# EAGLE schematic auxboard-schematics (EAGLE 7.6.0)
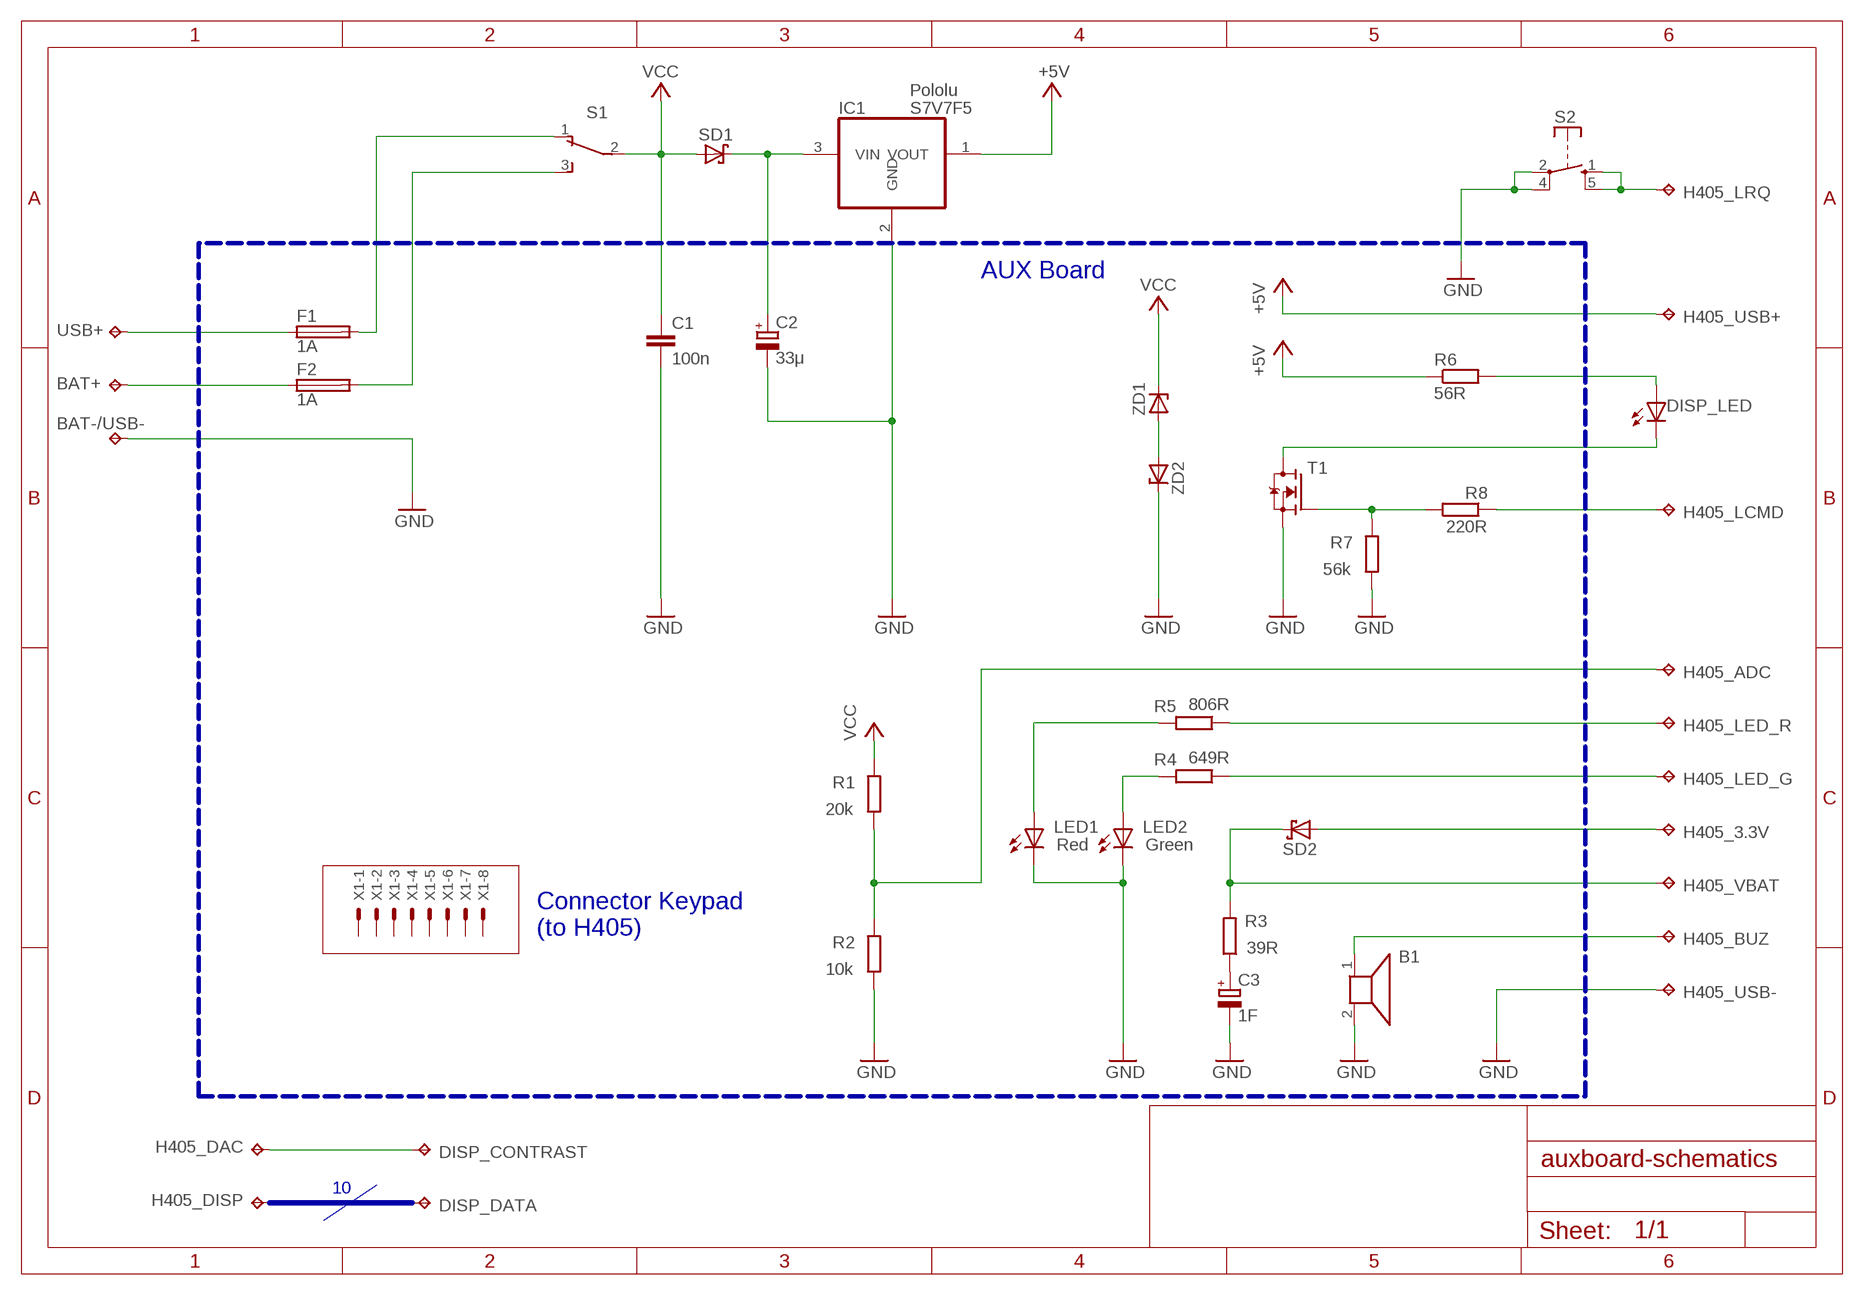
[diagram p0: schematic, sheet 1]

## Parts
B1  F/SMX  [F/SMX]
BAT+  TPPAD1-17  [P1-17]
BAT-/USB-  TPPAD1-17  [P1-17]
C1  100n  C-EU050-035X075  [C050-035X075]
C2  33μ  CPOL-EUUD-5X5,8  [UD-5X5,8_NICHICON]
C3  1F  CPOL-EUUD-5X5,8  [UD-5X5,8_NICHICON]
DISP_CONTRAST  TPPAD1-17  [P1-17]
DISP_DATA  TPPAD1-17  [P1-17]
DISP_LED  LAP4-BOTTOM  [P47F-BOTTOM]
F1  1A  FUSESH22,5A  [SH22,5A]
F2  1A  FUSESH22,5A  [SH22,5A]
H405_3.3V  TPPAD1-17  [P1-17]
H405_ADC  TPPAD1-17  [P1-17]
H405_BUZ  TPPAD1-17  [P1-17]
H405_DAC  TPPAD1-17  [P1-17]
H405_DISP  TPPAD1-17  [P1-17]
H405_LCMD  TPPAD1-17  [P1-17]
H405_LED_G  TPPAD1-17  [P1-17]
H405_LED_R  TPPAD1-17  [P1-17]
H405_LRQ  TPPAD1-17  [P1-17]
H405_USB+  TPPAD1-17  [P1-17]
H405_USB-  TPPAD1-17  [P1-17]
H405_VBAT  TPPAD1-17  [P1-17]
IC1  S7V7F5  REG1118  [SOT223]
LED1  Red  LAP4-BOTTOM  [P47F-BOTTOM]
LED2  Green  LAP4-BOTTOM  [P47F-BOTTOM]
R1  20k  R-EU_0207/2V  [0207/2V]
R2  10k  R-EU_0207/2V  [0207/2V]
R3  39R  R-EU_0207/2V  [0207/2V]
R4  649R  R-EU_0207/2V  [0207/2V]
R5  806R  R-EU_0207/2V  [0207/2V]
R6  56R  R-EU_0207/2V  [0207/2V]
R7  56k  R-EU_0207/2V  [0207/2V]
R8  220R  R-EU_0207/2V  [0207/2V]
S1  TL36YO  [TL3XYO]
S2  TME1  [TME1]
SD1  SCHOTTKY-DIODECB417-15  [CB417-15]
SD2  SCHOTTKY-DIODECB417-15  [CB417-15]
T1  SPW47N60S5  [P-TO247]
USB+  TPPAD1-17  [P1-17]
X1  22-23-2081  [22-23-2081]
ZD1  1N5333  [C1702-15]
ZD2  1N5333  [C1702-15]

## Nets
+5V: H405_USB+.TP IC1.1(VOUT) R6.1
GND: B1.2 BAT-/USB-.TP C1.2 C2.- C3.- H405_USB-.TP IC1.2(GND) LED1.C LED2.C R2.1 R7.1 S2.2(P) S2.4(P) T1.3(S) ZD2.C
N$1: F1.1 USB+.TP
N$2: BAT+.TP F2.1
N$3: R7.2 R8.2 T1.1(G)
N$4: F2.2 S1.3(S)
N$5: H405_LRQ.TP S2.1(S) S2.5(S)
N$6: DISP_LED.A R6.2
N$7: F1.2 S1.1(O)
N$8: DISP_LED.C T1.2(D)
N$9: H405_LCMD.TP R8.1
N$10: B1.1 H405_BUZ.TP
N$11: H405_ADC.TP R1.1 R2.2
N$12: H405_3.3V.TP SD2.A
N$13: H405_VBAT.TP R3.2 SD2.C
N$14: C3.+ R3.1
N$15: LED2.A R4.2
N$16: LED1.A R5.2
N$17: H405_LED_R.TP R5.1
N$18: H405_LED_G.TP R4.1
N$20: ZD1.A ZD2.A
N$21: C2.+ IC1.3(VIN) SD1.C
N$22: DISP_CONTRAST.TP H405_DAC.TP
VCC: C1.1 R1.2 S1.2(P) SD1.A ZD1.C
Unconnected: DISP_DATA.TP H405_DISP.TP X1.1 X1.2 X1.3 X1.4 X1.5 X1.6 X1.7 X1.8

## Buses
B$1
10
B$2

## Notes on the sheet
- Pololu
- AUX Board
- Connector Keypad
  (to H405)
- 10

## Library data of the parts
B1 = buzzer:F/SMX: BUZZER Source: Buerklin; OC_FARNELL: unknown; OC_NEWARK: unknown
BAT+ BAT-/USB- DISP_CONTRAST DISP_DATA H405_3.3V H405_ADC H405_BUZ H405_DAC H405_DISP H405_LCMD H405_LED_G H405_LED_R H405_LRQ H405_USB+ H405_USB- H405_VBAT USB+ = testpad:TP: Test pad
C1 = rcl:C-EU: CAPACITOR, European symbol
C2 C3 = rcl:CPOL-EU: POLARIZED CAPACITOR, European symbol
DISP_LED LED1 LED2 = led:*P4: PointLED® Enhanced Thinfilm LED TOP & BOTTOM mount LS P47F, LR P47F, LA P47F, LY P47F, LT P4SG, LB P4SG, LW P4SG Source: http://catalog.osram-os.com .. LA_LR_LS_LY_P47F_Pb_free.pdf
F1 F2 = fuse:FUSE: Fuse; OC_FARNELL: unknown; OC_NEWARK: unknown
IC1 = burr-brown:REG1118: 800mA Low Dropout (LDO) Positive Regulator with Current Source and Sink Capability; MPN: REG1118-2.85/2K5G4; OC_FARNELL: unknown; OC_NEWARK: 14M2185
R1-R8 = rcl:R-EU_: RESISTOR, European symbol
S1 = switch:TL36YO: TINY SWITCH ON - ON Source: http://www2.produktinfo.conrad.com/datenblaetter/700000-724999/705152-da-01-de-Subminiaturschalter_TL_36YO.pdf
S2 = switch-misc:TME1: SWITCH
SD1 SD2 = diode:SCHOTTKY-DIODE: Schottky Diode
T1 = transistor-fet:SPW47N60S5: Cool MOS Power Transistor
X1 = con-molex:22-23-2081: .100" (2.54mm) Center Header - 8 Pin; MF: MOLEX; MPN: 22-23-2081; OC_FARNELL: 1756826; OC_NEWARK: 01C7592
ZD1 ZD2 = diode:1N5333: Z DIODE 3.3 V, 5W, 5 percent (Motorola)